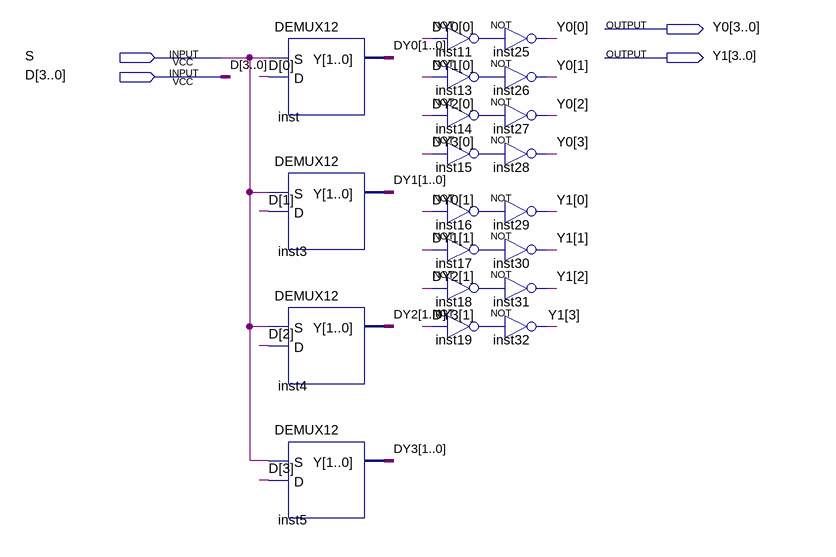
[diagram p0: schematic sheet]
// Quartus schematic DEMUX12_4.bdf as structural Verilog: 20 symbols, 4 pins
module DEMUX12_4 (
  input  S,
  input  [3:0] D,
  output [3:0] Y0,
  output [3:0] Y1
);

  wire inst11_out, inst13_out, inst14_out, inst15_out, inst16_out, inst17_out, inst18_out, inst19_out;
  wire [1:0] DY0, DY1, DY2, DY3;

  DEMUX12 inst (.S(S), .D(D[0]), .Y(DY0));
  DEMUX12 inst3 (.S(S), .D(D[1]), .Y(DY1));
  DEMUX12 inst4 (.S(S), .D(D[2]), .Y(DY2));
  DEMUX12 inst5 (.S(S), .D(D[3]), .Y(DY3));
  not inst11 (inst11_out, DY0[0]);
  not inst25 (Y0[0], inst11_out);
  not inst13 (inst13_out, DY1[0]);
  not inst26 (Y0[1], inst13_out);
  not inst14 (inst14_out, DY2[0]);
  not inst27 (Y0[2], inst14_out);
  not inst15 (inst15_out, DY3[0]);
  not inst28 (Y0[3], inst15_out);
  not inst16 (inst16_out, DY0[1]);
  not inst29 (Y1[0], inst16_out);
  not inst17 (inst17_out, DY1[1]);
  not inst30 (Y1[1], inst17_out);
  not inst18 (inst18_out, DY2[1]);
  not inst31 (Y1[2], inst18_out);
  not inst19 (inst19_out, DY3[1]);
  not inst32 (Y1[3], inst19_out);
endmodule
